# EAGLE schematic MB_1 (EAGLE 9.2.2)
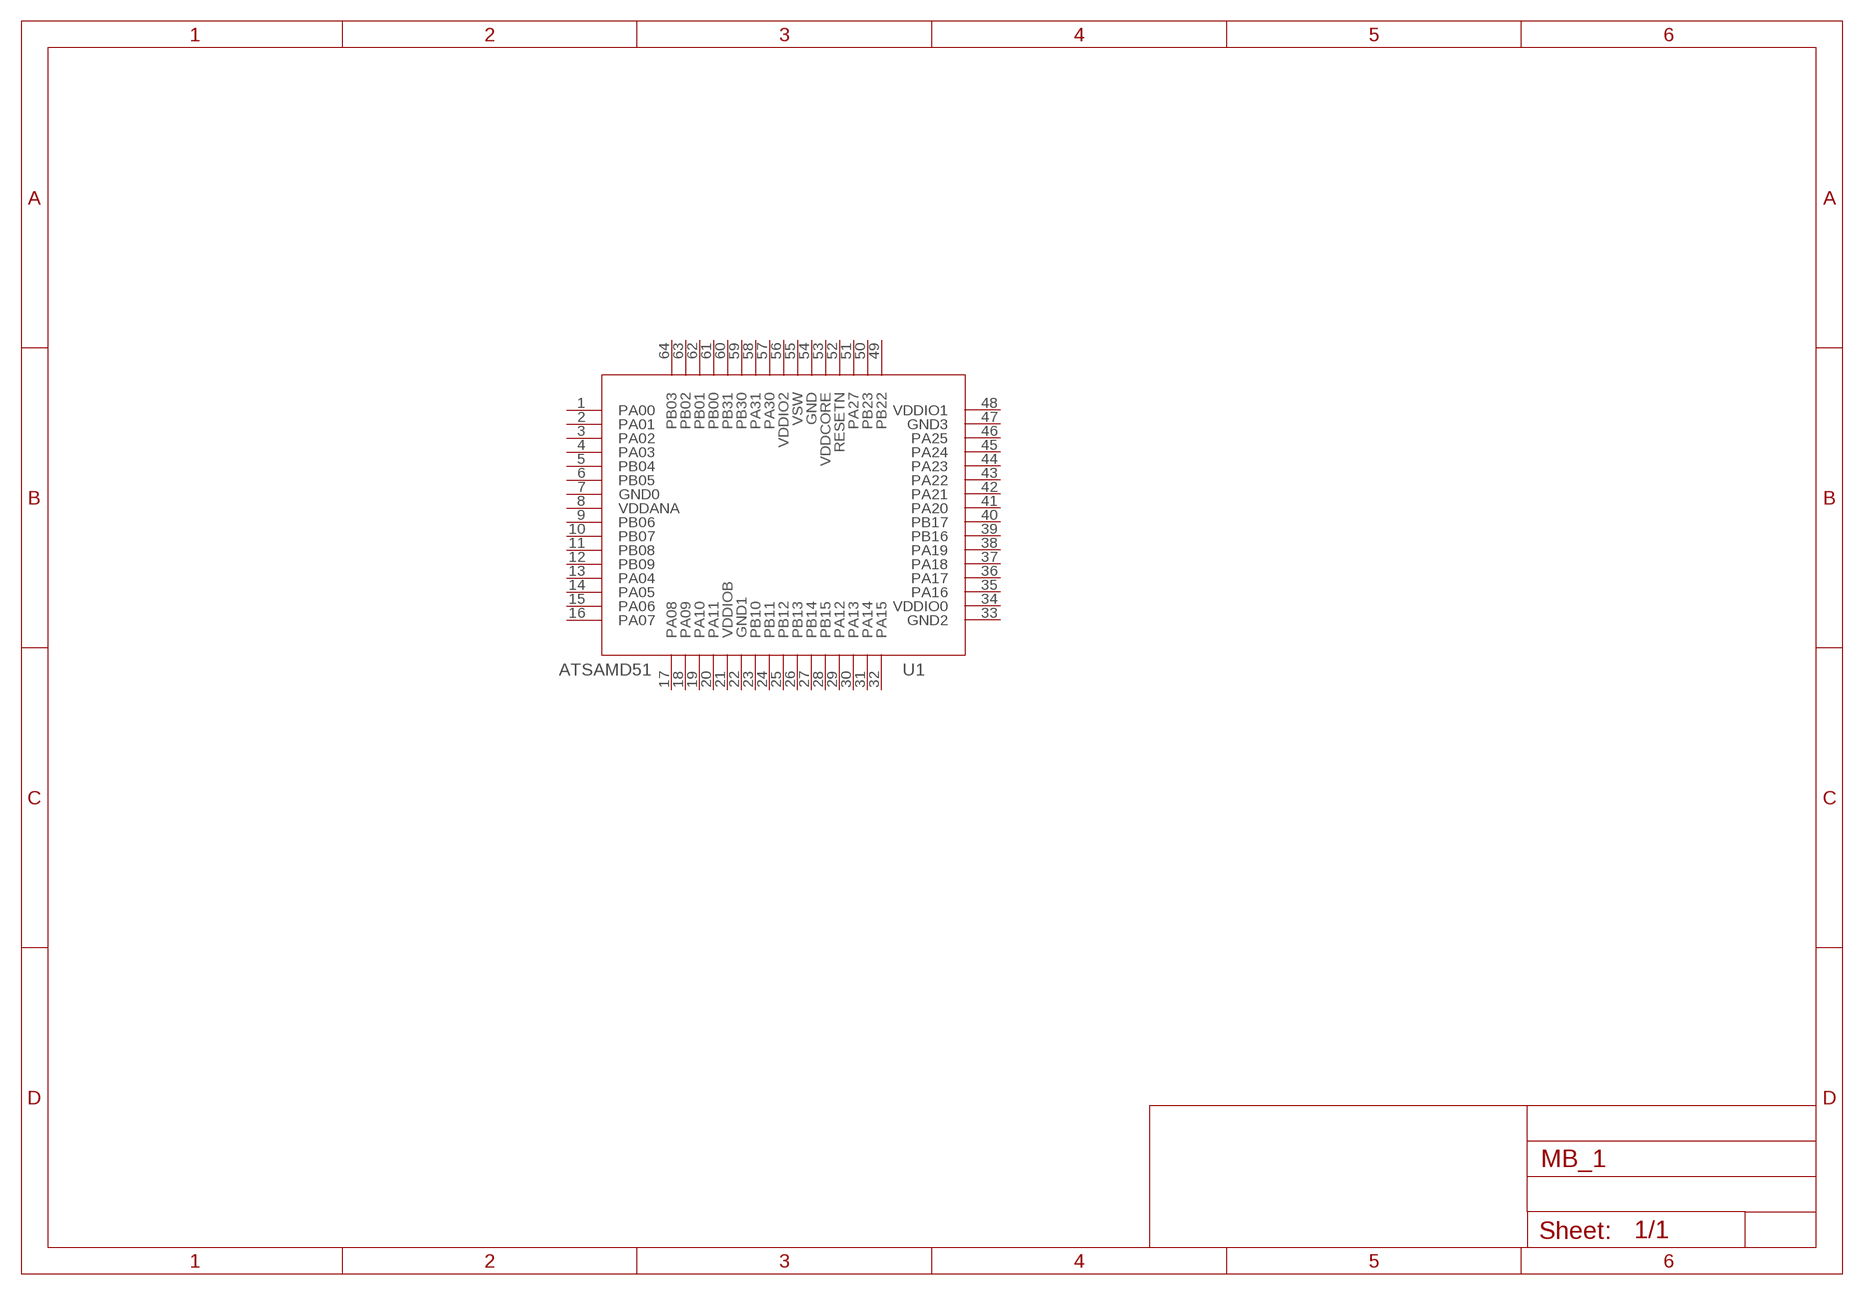
[diagram p0: schematic, sheet 1]

## Parts
U1  ATSAMD51  [TQFP64]
Unconnected: U1.1(PA00) U1.2(PA01) U1.3(PA02) U1.4(PA03) U1.5(PB04) U1.6(PB05) U1.9(PB06) U1.10(PB07) U1.11(PB08) U1.12(PB09) U1.13(PA04) U1.14(PA05) U1.15(PA06) U1.16(PA07) U1.17(PA08) U1.18(PA09) U1.19(PA10) U1.20(PA11) U1.23(PB10) U1.24(PB11) U1.25(PB12) U1.26(PB13) U1.27(PB14) U1.28(PB15) U1.29(PA12) U1.30(PA13) U1.31(PA14) U1.32(PA15) U1.35(PA16) U1.36(PA17) U1.37(PA18) U1.38(PA19) U1.39(PB16) U1.40(PB17) U1.41(PA20) U1.42(PA21) U1.43(PA22) U1.44(PA23) U1.45(PA24) U1.46(PA25) U1.49(PB22) U1.50(PB23) U1.51(PA27) U1.52(RESETN) U1.57(PA30) U1.58(PA31) U1.59(PB30) U1.60(PB31) U1.61(PB00) U1.62(PB01) U1.63(PB02) U1.64(PB03)

## Power pins joined to a net without a drawn wire
GND: U1.54(GND)
GND0: U1.7(GND0)
GND1: U1.22(GND1)
GND2: U1.33(GND2)
GND3: U1.47(GND3)
VDDANA: U1.8(VDDANA)
VDDCORE: U1.53(VDDCORE)
VDDIO0: U1.34(VDDIO0)
VDDIO1: U1.48(VDDIO1)
VDDIO2: U1.56(VDDIO2)
VDDIOB: U1.21(VDDIOB)
VSW: U1.55(VSW)

## Library data of the parts
U1 = atsamd5x:ATSAMD51